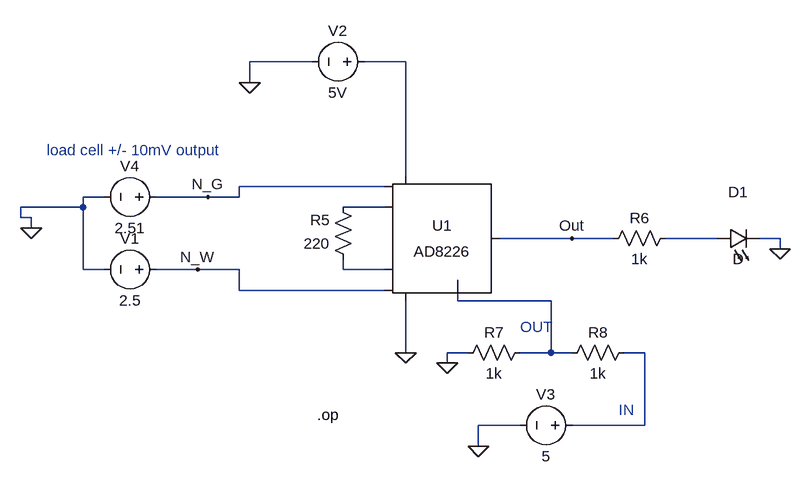
[diagram p0: schematic ms1.asc]
ms1.asc, the LTspice schematic file:
Version 4
SHEET 1 1312 1080
WIRE 576 112 480 112
WIRE 720 112 656 112
WIRE 480 144 480 112
WIRE 720 288 720 112
WIRE 688 304 464 304
WIRE 256 320 224 320
WIRE 416 320 336 320
WIRE 464 320 464 304
WIRE 464 320 416 320
WIRE 224 336 224 320
WIRE 224 336 128 336
WIRE 688 336 624 336
WIRE 128 352 128 336
WIRE 144 352 128 352
WIRE 144 368 144 352
WIRE 976 384 864 384
WIRE 1040 384 976 384
WIRE 1200 384 1120 384
WIRE 1296 384 1264 384
WIRE 1296 400 1296 384
WIRE 224 432 224 336
WIRE 256 432 224 432
WIRE 400 432 336 432
WIRE 464 432 400 432
WIRE 624 432 624 416
WIRE 688 432 624 432
WIRE 464 464 464 432
WIRE 688 464 464 464
WIRE 800 480 800 448
WIRE 944 480 800 480
WIRE 720 560 720 480
WIRE 816 560 784 560
WIRE 944 560 944 480
WIRE 944 560 896 560
WIRE 976 560 944 560
WIRE 1088 560 1056 560
WIRE 784 576 784 560
WIRE 896 672 832 672
WIRE 1088 672 1088 560
WIRE 1088 672 976 672
WIRE 832 704 832 672
FLAG 1296 400 0
FLAG 784 576 0
FLAG 832 704 0
FLAG 144 368 0
FLAG 720 560 0
FLAG 480 144 0
FLAG 416 320 N_G
FLAG 400 432 N_W
FLAG 976 384 Out
SYMBOL AD8226 720 384 R0
SYMATTR InstName U1
SYMBOL Res 640 432 R180
WINDOW 0 36 76 Left 2
WINDOW 3 36 40 Left 2
SYMATTR InstName R5
SYMATTR Value 220
SYMBOL LED 1200 400 R270
WINDOW 0 72 32 VTop 2
WINDOW 3 0 32 VBottom 2
SYMATTR InstName D1
SYMBOL Res 1136 368 R90
WINDOW 0 0 56 VBottom 2
WINDOW 3 32 56 VTop 2
SYMATTR InstName R6
SYMATTR Value 1k
SYMBOL voltage 672 112 R90
WINDOW 0 -32 56 VBottom 2
WINDOW 3 32 56 VTop 2
SYMATTR InstName V2
SYMATTR Value 5V
SYMBOL Voltage 992 672 R90
WINDOW 0 -32 56 VBottom 2
WINDOW 3 32 56 VTop 2
SYMATTR InstName V3
SYMATTR Value 5
SYMBOL Res 912 544 R90
WINDOW 0 0 56 VBottom 2
WINDOW 3 32 56 VTop 2
SYMATTR InstName R7
SYMATTR Value 1k
SYMBOL Res 1072 544 R90
WINDOW 0 0 56 VBottom 2
WINDOW 3 32 56 VTop 2
SYMATTR InstName R8
SYMATTR Value 1k
SYMBOL Voltage 352 432 R90
WINDOW 0 -32 56 VBottom 2
WINDOW 3 32 56 VTop 2
SYMATTR InstName V1
SYMATTR Value 2.5
SYMBOL Voltage 352 320 R90
WINDOW 0 -32 56 VBottom 2
WINDOW 3 32 56 VTop 2
SYMATTR InstName V4
SYMATTR Value 2.51
TEXT 584 656 Left 2 !.op
TEXT 168 248 Left 2 ;load cell +/- 10mV output
TEXT 1048 648 Left 2 ;IN
TEXT 896 520 Left 2 ;OUT

The netlist it stands for:
* ms1.asc
XU1 N_W N002 N004 N_G 0 N005 Out N001 AD8226
R5 N004 N002 220
D1 N003 0 D
R6 N003 Out 1k
V2 N001 0 5V
V3 N006 0 5
R7 N005 0 1k
R8 N006 N005 1k
V1 N_W 0 2.5
V4 N_G 0 2.51
.model D D
.lib standard.dio
.op
* load cell +/- 10mV output
* IN
* OUT
.lib ADI1.lib
.backanno
.end